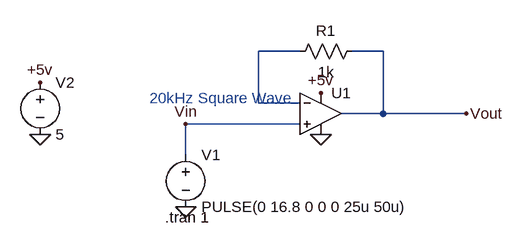
[diagram p0: schematic PWM to Analog with op amp buffer.asc]
PWM to Analog with op amp buffer.asc, the LTspice schematic file:
Version 4
SHEET 1 880 680
WIRE 0 16 -64 16
WIRE 128 16 80 16
WIRE -64 96 -64 16
WIRE 0 96 -64 96
WIRE 128 112 128 16
WIRE 128 112 64 112
WIRE 256 112 128 112
WIRE 0 128 -176 128
WIRE -176 176 -176 128
FLAG -176 256 0
FLAG -176 128 Vin
FLAG 32 144 0
FLAG 32 80 +5v
FLAG -400 144 0
FLAG -400 64 +5v
FLAG 256 112 Vout
SYMBOL voltage -176 160 R0
WINDOW 123 0 0 Left 0
WINDOW 39 0 0 Left 0
SYMATTR InstName V1
SYMATTR Value PULSE(0 16.8 0 0 0 25u 50u)
SYMBOL OpAmps\\UniversalOpamp2 32 112 R0
SYMATTR InstName U1
SYMBOL voltage -400 48 R0
WINDOW 123 0 0 Left 0
WINDOW 39 0 0 Left 0
SYMATTR InstName V2
SYMATTR Value 5
SYMBOL res 96 0 R90
WINDOW 0 0 56 VBottom 2
WINDOW 3 32 56 VTop 2
SYMATTR InstName R1
SYMATTR Value 1k
TEXT -208 272 Left 2 !.tran 1
TEXT -232 88 Left 2 ;20kHz Square Wave

The netlist it stands for:
* PWM to Analog with op amp buffer.asc
V1 Vin 0 PULSE(0 16.8 0 0 0 25u 50u)
XU1 Vin N001 +5v 0 Vout level.2 Avol=1Meg GBW=10Meg Slew=10Meg ilimit=25m rail=0 Vos=0 phimargin=45 en=0 enk=0 in=0 ink=0 Rin=500Meg  ; pins IN+ IN- V+ V- OUT
V2 +5v 0 5
R1 Vout N001 1k
.tran 1
* 20kHz Square Wave
.lib UniversalOpamps2.sub
.backanno
.end